# EAGLE design Adafruit Proximity Trinkey (EAGLE 9.6.2)
AUTHOR: ladyada
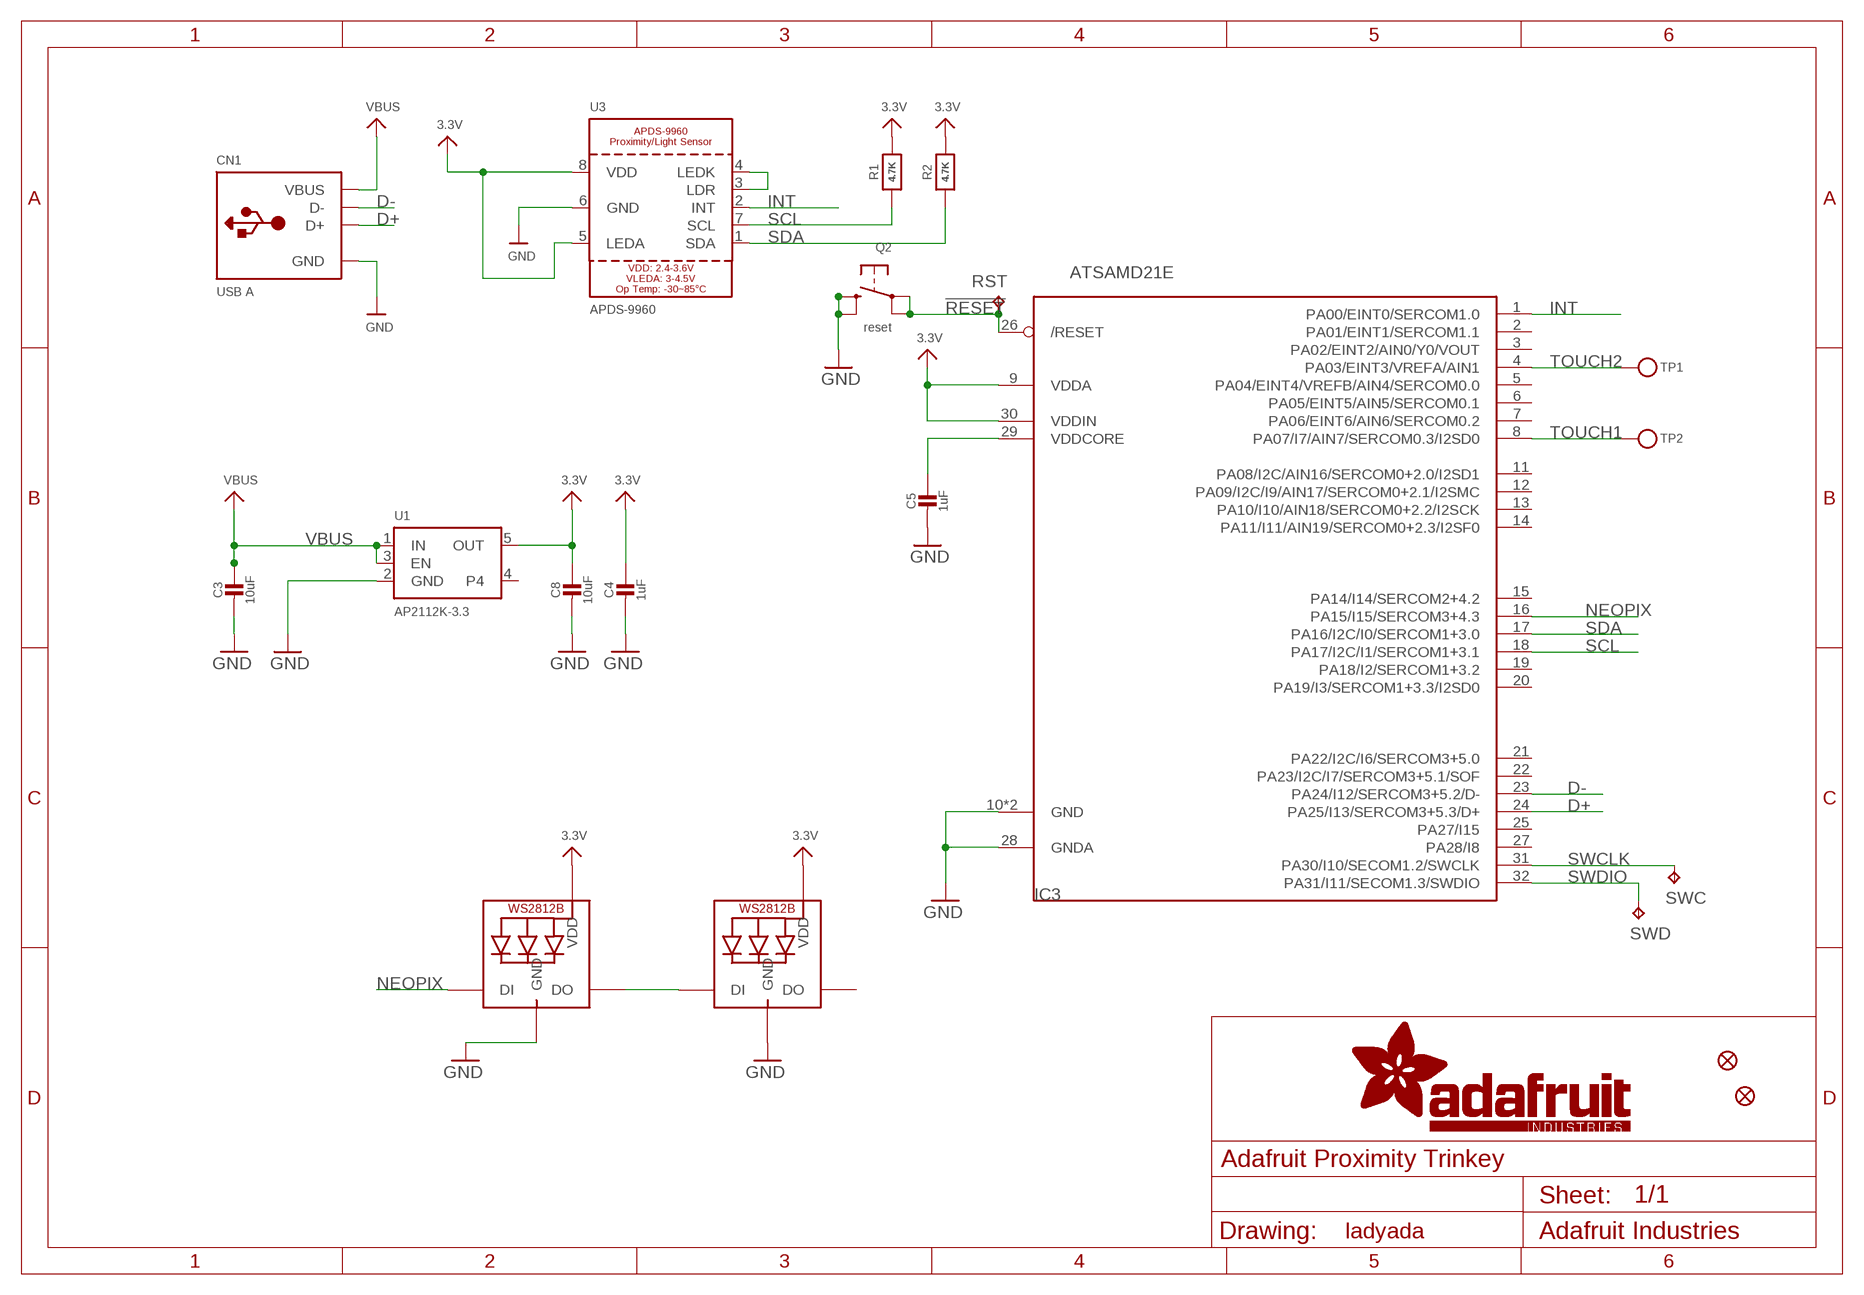
[diagram p0: schematic, sheet 1]

## Parts
C3  10uF  CAP_CERAMIC0805-NOOUTLINE  [0805-NO]
C4  1uF  CAP_CERAMIC0603_NO  [0603-NO]
C5  1uF  CAP_CERAMIC0603_NO  [0603-NO]
C8  10uF  CAP_CERAMIC0805-NOOUTLINE  [0805-NO]
CN1  USB A  USB_TYPEAPCB  [USBA_PCB]
FID1  FIDUCIAL_1MM  [FIDUCIAL_1MM]
FID2  FIDUCIAL_1MM  [FIDUCIAL_1MM]
IC3  ATSAMD21E  [QFN32_5MM]
LED1  WS2812B3535  [LED3535]
LED2  WS2812B3535  [LED3535]
Q2  reset  SWITCH_TACT_SMT4.6X2.8  [BTN_KMR2_4.6X2.8]
R1  4.7K  RESISTOR_0603_NOOUT  [0603-NO]
R2  4.7K  RESISTOR_0603_NOOUT  [0603-NO]
RST  TPTP16R  [TP16R]
SWC  TPTP15R  [TP15R]
SWD  TPTP16R  [TP16R]
TP1  TESTPOINTROUND1.5MMNO  [TESTPOINT_ROUND_1.5MM_NO]
TP2  TESTPOINTROUND1.5MMNO  [TESTPOINT_ROUND_1.5MM_NO]
U1  AP2112K-3.3  VREG_SOT23-5  [SOT23-5]
U3  APDS-9960  [APDS-9960]

## Nets
3.3V: C4.1 C8.1 IC3.9(VDDA) IC3.30(VDDIN) LED1.2(VDD) LED2.2(VDD) R1.2 R2.2 U1.5(OUT) U3.5(LEDA) U3.8(VDD)
!RESET: IC3.26(/RESET) Q2.A'(P1) Q2.A(P) RST.TP
D+: CN1.USB_PLUS(D+) IC3.24(PA25/I13/SERCOM3+5.3/D+)
D-: CN1.USB_NEG(D-) IC3.23(PA24/I12/SERCOM3+5.2/D-)
GND: C3.2 C4.2 C5.2 C8.2 CN1.GND IC3.10(GND) IC3.28(GNDA) IC3.33(GND) LED1.4(GND) LED2.4(GND) Q2.B'(S1) Q2.B(S) U1.2(GND) U3.6(GND)
INT: IC3.1(PA00/EINT0/SERCOM1.0) U3.2(INT)
N$1: LED1.1(DI) LED2.3(DO)
N$4: U3.3(LDR) U3.4(LEDK)
NEOPIX: IC3.16(PA15/I15/SERCOM3+4.3) LED2.1(DI)
SCL: IC3.18(PA17/I2C/I1/SERCOM1+3.1) R1.1 U3.7(SCL)
SDA: IC3.17(PA16/I2C/I0/SERCOM1+3.0) R2.1 U3.1(SDA)
SWCLK: IC3.31(PA30/I10/SECOM1.2/SWCLK) SWC.TP
SWDIO: IC3.32(PA31/I11/SECOM1.3/SWDIO) SWD.TP
TOUCH1: IC3.8(PA07/I7/AIN7/SERCOM0.3/I2SD0) TP2.P$1
TOUCH2: IC3.4(PA03/EINT3/VREFA/AIN1) TP1.P$1
VBUS: C3.1 CN1.VCC(VBUS) U1.1(IN) U1.3(EN)
VDDCORE1: C5.1 IC3.29(VDDCORE)
Unconnected: IC3.2(PA01/EINT1/SERCOM1.1) IC3.3(PA02/EINT2/AIN0/Y0/VOUT) IC3.5(PA04/EINT4/VREFB/AIN4/SERCOM0.0) IC3.6(PA05/EINT5/AIN5/SERCOM0.1) IC3.7(PA06/EINT6/AIN6/SERCOM0.2) IC3.11(PA08/I2C/AIN16/SERCOM0+2.0/I2SD1) IC3.12(PA09/I2C/I9/AIN17/SERCOM0+2.1/I2SMC) IC3.13(PA10/I10/AIN18/SERCOM0+2.2/I2SCK) IC3.14(PA11/I11/AIN19/SERCOM0+2.3/I2SF0) IC3.15(PA14/I14/SERCOM2+4.2) IC3.19(PA18/I2/SERCOM1+3.2) IC3.20(PA19/I3/SERCOM1+3.3/I2SD0) IC3.21(PA22/I2C/I6/SERCOM3+5.0) IC3.22(PA23/I2C/I7/SERCOM3+5.1/SOF) IC3.25(PA27/I15) IC3.27(PA28/I8) LED1.3(DO) U1.4

## Library data of the parts
C3-C5 C8 = microbuilder:CAP_CERAMIC: Ceramic Capacitors For new designs, use the packages preceded by an '_' character since they are more reliable: The following footprints should be used on most boards: _0402 - Standard footprint for regular board layouts _0603 - Standard footprint for regular board layouts _0805 - Standard footprint for regular board layouts _1206 - Standard footprint for regular board layouts For extremely tight-pitch boards where space is at a premium, the following 'micro-pitch' footprints can be used (smaller pads, no silkscreen outline, etc.): _0402MP - Micro-pitch footprint for very dense/compact boards _0603MP - Micro-pitch footprint for very dense/compact boards _0805MP - Micro-pitch footprint for very dense/compact boards _1206MP - Micro-pitch footprint for very dense/compact boards
CN1 = microbuilder:USB_TYPEA: USB - Type A Connectors Male types stick out and are inserted into a PC or matching females parts (these are the connectors used on USB Memory Sticks, etc.). Female parts are generally used for USB Host and accept a male-type connector. SMT - 4UCON: 10017 PTHFML - Digikey: 609-1045-ND, 4UCon: 05241 PCB - Use 2.0mm thick PCBs with this footprint
FID1 FID2 = microbuilder:FIDUCIAL: Fiducial Alignment Points Various fiducial points for machine vision alignment.; BOM: EXCLUDE
IC3 = microbuilder:ATSAMD21E
LED1 LED2 = adafruit:WS2812B
Q2 = microbuilder:SWITCH_TACT_SMT: SMT Tact Switches 6x6mm - Digikey: P12940SCT-ND KMR2 (4.6x2.8mm) - Digikey: 401-1426-1-ND EVQ-PQHB55 - Light Touch, 160GF (4.5x4.5mm) - Digikey: P8090SCT-ND KMT0 - KMT021 NGJ LHS (etc.) IP68/Waterproof - Digikey: CKN10289CT-ND
R1 R2 = microbuilder:RESISTOR: Resistors For new designs, use the packages preceded by an '_' character since they are more reliable: The following footprints should be used on most boards: _0402 - Standard footprint for regular board layouts _0603 - Standard footprint for regular board layouts _0805 - Standard footprint for regular board layouts _1206 - Standard footprint for regular board layouts For extremely tight-pitch boards where space is at a premium, the following 'micro-pitch' footprints can be used (smaller pads, no silkscreen outline, etc.): _0402MP - Micro-pitch footprint for very dense/compact boards _0603MP - Micro-pitch footprint for very dense/compact boards _0805MP - Micro-pitch footprint for very dense/compact boards _1206MP - Micro-pitch footprint for very dense/compact boards
RST SWC SWD = testpad:TP: Test pad
TP1 TP2 = microbuilder:TESTPOINT: Test Point Various test points for characterisation and PCB testing TESTPOINT_SMT - Compact Surface Mount Test Point [Digikey: 5016KTR-ND]
U1 = microbuilder:VREG_SOT23-5: SOT23-5 Fixed Voltage Regulators Part Current Out V Out V In V Dropout θJA (°C/W) TJ (°C) Digikey Part No. ADP121 150mA 3.3V 3.4-5.5V 0.09V @ 150mA -- -- ADP121-AUJZ33R7CT-ND ADP121 150mA 3.0V 3.1-5.5V 0.09V @ 150mA -- -- ADP121-AUJZ30R7CT-ND ADP122 300mA 3.3V 3.4-5.5V 0.085V @ 300mA -- -- ADP122AUJZ-3.3-R7CT-ND ADP1712 300mA 3.3V 3.5-5.5V 0.17V @ 300mA -- -- ADP1712AUJZ-3.3-R7TR-ND AP7311 (Low Cost) 150mA 3.3V 3.5-6V 0.15V @ 150mA -- -- AP7311-33WG-7DICT-ND LD39015M18R 150mA 1.8V 1.9V-5.5V 0.08V @ 100mA -- -- 497-6977-1-ND LP2985A-33DBVR 150mA 3.3V 3.3-16V 0.28V @ 150mA 206 150 296-18479-1-ND MCP1824T-3302E/OT 300mA 3.3V 3.5V-6V 0.2V @ 300mA -- -- MCP1824T-3302E/OTCT-ND MIC5205-2.5YM5 TR 150mA 2.5V 2.7-16V 0.165V @ 150mA -- -- 576-1257-2-ND MIC5205-3.0YM5 TR 150mA 3.0V 3.2V-16V 0.165V @ 150mA -- -- 576-1258-2-ND MIC5205-3.3YM5 TR 150mA 3.3V 3.5V-16V 0.165V @ 150mA -- -- 576-1259-2-ND TPS780330220 150mA 3.3V+2.2V 3.6-5.5V 250mV Max -- -- 296-23332-1-ND TDA3663/N1,135 100mA 3.3V 3.5-45V 0.18V @ 50mA -- -- 568-5343-1-ND Max operating temp can be calculated using θJA, TJ (max junction temperature), and power in watts. Set the "Maximum Ambient Temperature" until it reaches TJ ("Max Junction Temperature"), which is the absolute limit for safe use of the regulator: Heat Sink Temperature Calculator <http://www.daycounter.com/Calculators/Heat-Sink-Temperature-Calculator.phtml> For example, With 12V source into a 3.3V LP2985 and a 30mA load, we are dissipating (12V-3.3V) * 0.03A = 0.261W. With a θJA of 206 °C/W, a TJ of 150°C, and 261mW we can safely use the chip without a heat sink up to 75°C (=147.1°C Junction Temperature).
U3 = microbuilder:APDS-9960: APDS-9960 - Digital Proximity Sensor with Ambient Light/RGB/Gesture Detection

## Net classes
1 highpower: width 0.406 mm, drill 0.483 mm
2 lowpower: width 0.305 mm, drill 0.483 mm

## Board
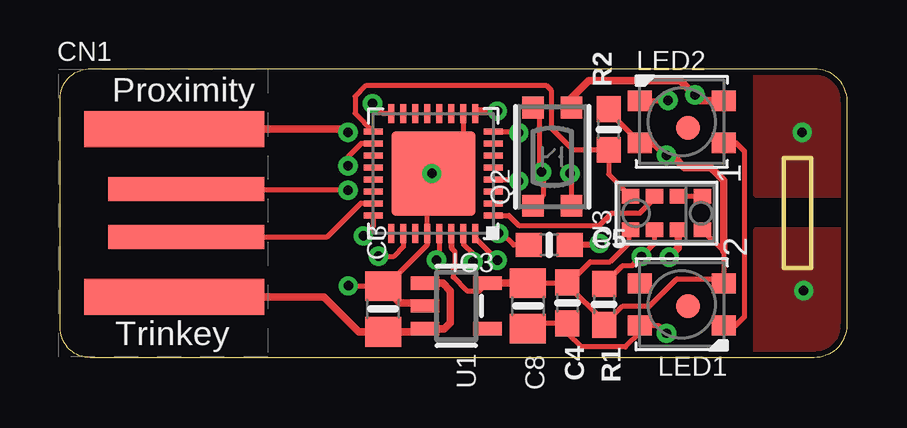
[diagram p1: board, top side]
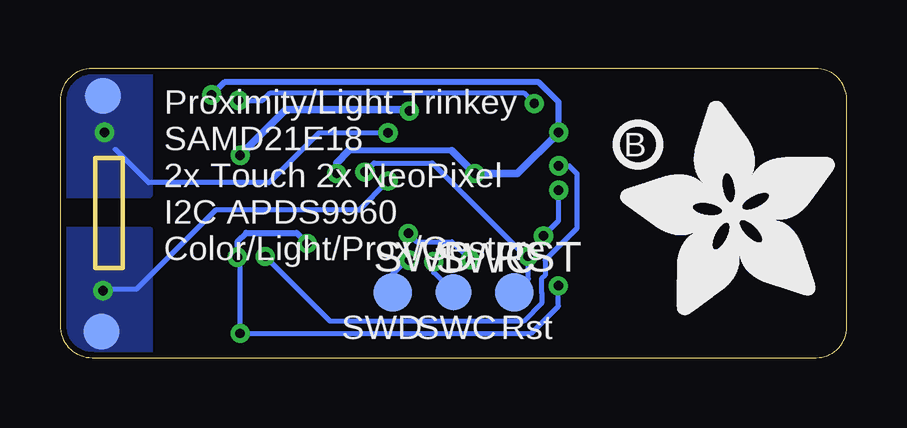
[diagram p2: board, bottom side, seen from below]

Size 32.78 x 12.06 mm. Coordinates in mm from the lower left corner, seen from the top.
Outline: 0,10.79 arc-90 1.3,12.06 31.43,12.06 arc-90 32.78,10.71 32.78,1.35 arc-90 31.43,0 1.27,0 arc-90 0,1.27 0,10.79
Copper layers (1*16): Top 0.035mm / dielectric 1.5mm / Bottom 0.035mm
Design rules "adafruit 8-8": minimum track width 6mil, minimum drill 15.5mil, track to track 8mil, track to pad 8mil, pad to pad 8mil, via to via 8mil, smd to smd 8mil, copper to edge 10mil, drill to drill 8mil, minimum pad ring 10mil, minimum via ring 8mil, stop-mask expansion 2mil, vias tented up to drill 20mil, thermal gap 10mil
Milling: 4 lines

### Footprints (pad centres in the part's own frame; a part is rotated, then mirrored left to right if it is on the bottom)
0805-NO = smd 1.24 x 1.5: 1 -0.95,0; 2 0.95,0
0603-NO = smd 1.075 x 1: 1 -0.85,0; 2 0.85,0
USBA_PCB = smd 7.5 x 1.5: GND -0.2,3.5; VCC -0.2,-3.5 | smd 6.5 x 1: USB_NEG 0.3,-1; USB_PLUS 0.3,1
FIDUCIAL_1MM = smd 1 x 1: 1 0,0
QFN32_5MM = smd 0.8 x 0.25: 1 -2.5,1.75; 2 -2.5,1.25; 3 -2.5,0.75; 4 -2.5,0.25; 5 -2.5,-0.25; 6 -2.5,-0.75; 7 -2.5,-1.25; 8 -2.5,-1.75; 17 2.5,-1.75; 18 2.5,-1.25; 19 2.5,-0.75; 20 2.5,-0.25; 21 2.5,0.25; 22 2.5,0.75; 23 2.5,1.25; 24 2.5,1.75 | smd 0.25 x 0.8: 9 -1.75,-2.5; 10 -1.25,-2.5; 11 -0.75,-2.5; 12 -0.25,-2.5; 13 0.25,-2.5; 14 0.75,-2.5; 15 1.25,-2.5; 16 1.75,-2.5; 25 1.75,2.5; 26 1.25,2.5; 27 0.75,2.5; 28 0.25,2.5; 29 -0.25,2.5; 30 -0.75,2.5; 31 -1.25,2.5; 32 -1.75,2.5 | smd 3.5 x 3.5: 33 0,0
LED3535 = smd 1 x 0.85: 1 -1.75,0.875; 2 -1.75,-0.875; 3 1.75,-0.875; 4 1.75,0.875
BTN_KMR2_4.6X2.8 = smd 0.9 x 0.9: A 2.05,0.8; A' -2.05,0.8; B 2.05,-0.8; B' -2.05,-0.8
TP16R = smd 1.6 x 1.6: TP 0,0
TP15R = smd 1.5 x 1.5: TP 0,0
TESTPOINT_ROUND_1.5MM_NO = smd 1.5 x 1.5: P$1 0,0
SOT23-5 = smd 0.55 x 1.2: 1 -0.95,-1.3; 2 0,-1.3; 3 0.95,-1.3; 4 0.95,1.3; 5 -0.95,1.3
APDS-9960 = smd 0.6 x 0.72: 1 0.7,1.505; 2 0.7,0.505; 3 0.7,-0.495; 4 0.7,-1.495; 5 -0.7,-1.495; 6 -0.7,-0.495; 7 -0.7,0.505; 8 -0.7,1.505

### Placement (x,y rotation side)
C3  13.46,2.03 90 top
C4  21.15,2.29 270 top
C5  20.38,4.7 0 top
C8  19.49,2.16 270 top
CN1  4.95,6.03 0 top
FID1  26.16,9.59 0 top
FID2  26.17,2.16 0 top
IC3  15.56,7.68 180 top
LED1  25.91,2.22 180 top
LED2  25.91,9.84 0 top
Q2  20.51,8.38 90 top
R1  22.67,2.22 270 top
R2  22.86,9.53 90 top
RST  13.84,2.73 0 bottom
SWC  16.38,2.73 0 bottom
SWD  18.92,2.73 0 bottom
TP1  31.05,1.08 0 bottom
TP2  30.99,10.92 0 bottom
U1  16.51,2.16 270 top
U3  25.27,6.03 90 top
U$8  [PCBFEAT-REV-040]  8.7,8.89 180 bottom
U$10  [ADAFRUIT_9MM]  0.51,1.78 90 bottom

### Tracks (layer width: path | path; a pad name or v marks a point on that pad's centre or on a via)
3.3V  (via drill 0.39)
  Top 0.203: R2.2 22.86,10.27 LED2.2 | U3.8 23.77,5.4 23.63,5.4 23.69,5.46 23.69,4.77 22.93,4 22.1,4 21.23,3.14 C4.1 | U3.5 27.66,4.44 LED1.2 27.47,3.29 25.7,3.29 24.57,2.16 23.46,2.16 R1.2 22.67,1.51 21.14,3.03 C4.1 | C8.1 21.12,3.11 C4.1 | 16.31,4.61 16.31,4.58 16.45,4.43 16.45,3.72 16.38,3.65 16.38,3.37 16.95,2.79 17.5,2.79 U1.5
  Top 0.254: IC3.30 16.31,4.61 | v25.27,8.45 25.21,8.45 24.74,8.91
  Top 0.305: U1.5 C8.1 | LED2.2 24.21,8.91 24.74,8.91 | v25.27,8.45 25.34,8.38 25.57,8.38 26.01,7.94 27.11,7.94 27.66,7.39 27.66,4.44 | IC3.9 17.41,10.29 v18.22,10.29
  Bottom 0.305: v18.22,10.29 18.29,10.35 23.37,10.35 v25.27,8.45
!RESET  (via drill 0.39)
  Top 0.203: IC3.26 14.31,4.63 13.91,4.23 v13.27,4.23 | Q2.A' 20.13,6.75 20.13,7.68 v20.07,7.75 19.96,7.75 19.96,10.18 Q2.A
  Bottom 0.203: 13.27,3.3 v13.27,4.23 13.38,4.23 17.27,8.13 19.68,8.13 v20.07,7.75
  Bottom 0.254: RST.TP 13.27,3.3
D+  (via drill 0.39)
  Top 0.203: IC3.24 13.06,5.5 v12.64,5.08 | 11.81,6.99 6.03,6.99 5.97,7.05 5.27,7.05 CN1.USB_PLUS
  Top 0.254: v12,6.99 11.81,6.99
  Bottom 0.203: v12.64,5.08 12,5.71 v12,6.99
D-
  Top 0.203: IC3.23 12.53,6.43 11.11,5.02 5.27,5.02 CN1.USB_NEG
GND  (via drill 0.39)
  Top 0.203: IC3.10 16.81,8.93 IC3.33 | v15.49,7.68 15.31,7.5 IC3.28 15.31,4.7 13.84,3.24 | v21.25,7.68 21.31,7.62 Q2.B' | C8.2 19.72,1.44 C4.2 21.14,1.02 21.72,0.45 23.56,0.45 24.16,1.04 24.16,1.21 | 24.26,1.35 24.94,1.35 25.18,1.11 | v12.01,3 12.03,2.98 13.08,2.98
  Top 0.254: v22.48,4.76 22.42,4.7 C5.2 | v25.27,1.02 | v25.27,1.02 25.18,1.11 | 24.16,1.21 LED1.4 24.26,1.35 | 26.54,10.86 26.54,10.88 v26.46,10.96 26.44,10.96 26.29,11.11 | v15.49,7.68 IC3.33 v15.49,7.68 | C3.2 13.08,2.98 | C3.2 13.59,2.98 13.84,3.24 | C3.2 13.78,2.67
  Top 0.305: 13.78,2.67 14.16,2.29 15.08,2.29 U1.2 | U3.6 25.77,4.57 v25.39,4.19 | LED2.4 26.68,10.72 26.29,11.11 25.84,11.56 22.04,11.56 21.31,10.83 Q2.B | v12,9.4 11.87,9.53 CN1.GND
  Bottom 0.203: 25.27,1.21 25.27,4.08 v25.39,4.19 | 25.02,1.02 13.14,1.02 12.01,2.15 v12.01,3
  Bottom 0.254: 16.45,8.64 20.74,8.64 | v22.48,4.76 22.92,5.21 25.02,5.21 25.39,4.84 v25.39,4.19 | v12,9.4 12,10.67 12.83,11.49 25.93,11.49 v26.46,10.96 | 25.02,1.02 v25.27,1.02 25.27,1.21 | v26.46,10.96 | 15.11,7.68 v15.49,7.68 15.62,7.81
  Bottom 0.305: 15.62,7.81 16.45,8.64 | 20.74,8.64 21.25,8.13 v21.25,7.68 | 15.11,7.68 13.72,7.68 v12,9.4
INT
  Top 0.203: IC3.1 18.7,5.93 19.11,5.52 22.48,5.52 22.99,6.03 24.16,6.03 24.77,6.64 U3.2
N$1
  Top 0.203: LED2.3 28.17,8.97 28.51,8.62 28.51,1.69 28.17,1.35 LED1.1
N$4
  Top 0.203: U3.4 U3.3
NEOPIX  (via drill 0.39)
  Top 0.203: LED2.1 25.32,10.72 v25.34,10.73 | IC3.16 13.44,10.18 v13.02,10.6
  Bottom 0.203: v25.34,10.73 24.33,10.73 24.02,11.05 13.46,11.05 v13.02,10.6
SCL  (via drill 0.39)
  Top 0.203: R1.1 23.43,3.83 23.84,3.83 23.84,3.84 v24.23,4.22 24.77,4.77 U3.7 | IC3.18 12.55,8.93 12,8.39 v12,8
  Bottom 0.203: v12,8 11.56,8 11.24,7.68 11.24,5.4 12.57,4.07 12.57,3.44 12.72,3.29 12.72,2.71 12.7,2.69 12.7,2.29 13.46,1.52 21.53,1.52 v24.23,4.22
SDA
  Top 0.203: U3.1 22.86,7.64 R2.1 21.36,8.68 20.46,9.57 20.46,11.16 20.26,11.37 12.76,11.37 12.3,10.9 12.3,10.2 IC3.17
SWCLK  (via drill 0.39)
  Top 0.203: IC3.31 16.81,4.72 17.21,4.32 v17.21,4
  Bottom 0.203: v17.21,4 17.21,3.56 SWC.TP
SWDIO  (via drill 0.39)
  Top 0.203: v18.22,4.06 18.22,4.08 17.31,4.99 IC3.32
  Bottom 0.203: v18.22,4.06 18.35,4.06 18.92,3.49 SWD.TP
TOUCH1  (via drill 0.39)
  Top 0.203: IC3.8 19.06,9.43 v19.11,9.38
  Bottom 0.203: v19.11,9.38 21.99,9.38 24.07,7.3 29.08,7.3 30.48,8.7
  other vias: 30.92,9.4
  pour Top: 29.02,12.06 32.77,12.06 32.77,6.79 29.02,6.79
  pour Bottom (no thermals): 29.02,12.06 32.77,12.06 32.77,6.79 29.02,6.79
TOUCH2  (via drill 0.39)
  Top 0.203: IC3.4 19.05,7.43 v19.11,7.37
  Bottom 0.203: v19.11,7.37 20.32,6.16 26.29,6.16 29.59,2.86 30.99,2.86
  other vias: 30.99,2.79
  pour Top: 29.02,5.33 32.77,5.33 32.77,0 29.02,0
  pour Bottom (no thermals): 29.02,5.33 32.77,5.33 32.77,0.06 29.02,0.06
VBUS
  Top 0.254: 15.08,1.08 U1.3 15.37,1.21
  Top 0.305: 15.08,1.08 C3.1 12.44,1.08 10.99,2.53 CN1.VCC | 15.37,1.21 16,1.21 16.26,1.46 16.26,2.79 15.94,3.11 U1.1
VDDCORE1  (via drill 0.39)
  Top 0.203: IC3.29 15.81,4.2 v15.69,4.07 | C5.1 18.9,4.7 18.41,5.18 v18.27,5.18
  Bottom 0.203: v15.69,4.07 16.45,4.84 17.92,4.84 v18.27,5.18

### Text on the board
tPlace: Proximity | 1 | 2 | Trinkey
bPlace: Proximity/Light Trinkey / SAMD21E18 / 2x Touch 2x NeoPixel / I2C APDS9960 / Color/Light/Prox/Gesture | Rst | SWC | SWD
tValues: C1898